# Altium schematic sheet TP4056电源模块.SchDoc
size A4
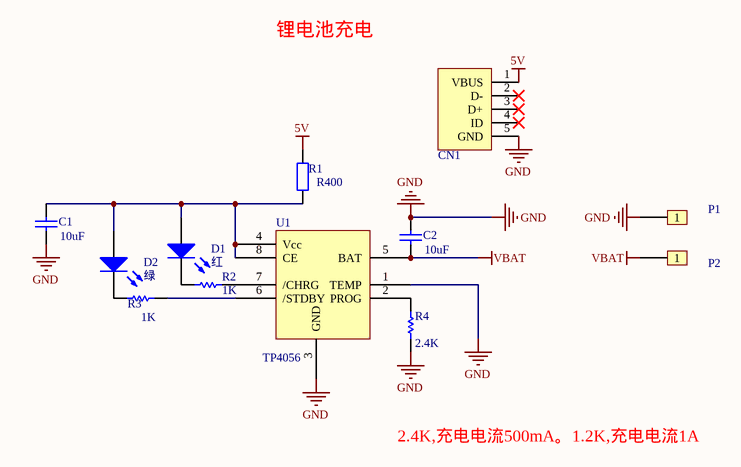
[diagram p0: TP4056电源模块.SchDoc]

## Parts
C1  value 10uF  [0603C]  (hidden comment: Cap)
C2  value 10uF  [0603C]  (hidden comment: Cap)
CN1  microUSB  [MICRO-USB]  (value not drawn)
D1  红  [0805D]
D2  绿  [0805D]
P1  Header1  [Header1]  (value not drawn)
P2  Header1  [Header1]  (value not drawn)
R1  value R400  [1206R]  (hidden comment: Res2)
R2  value 1K  [0603R]  (hidden comment: Res1)
R3  value 1K  [0603R]  (hidden comment: Res1)
R4  value 2.4K  [0603R]  (hidden comment: Res1)
U1  TP4056  [SOP-8]

## Nets
5V: CN1.1(VBUS) R1.2
GND: C1.1 C2.2 CN1.5(GND) P1.1 R4.1 U1.1(TEMP) U1.3(GND)
VBAT: C2.1 P2.1 U1.5(BAT)
NetC1_2: C1.2 D1.1(A) D2.1(A) R1.1 U1.4(Vcc) U1.8(CE)
NetD1_2: D1.2(K) R2.1
NetD2_2: D2.2(K) R3.1
NetR2_2: R2.2 U1.7(/CHRG)
NetR3_2: R3.2 U1.6(/STDBY)
NetR4_2: R4.2 U1.2(PROG)

Not connected (* = marked no-connect by the designer): CN1 2(D-)* 3(D+)* 4(ID)*

## Notes on the sheet
- 锂电池充电
- 2.4K,充电电流500mA。1.2K,充电电流1A

## Library data of the parts
C1 C2 = Cap: Capacitor; Published: 8-Jun-2000; LatestRevisionDate: 17-Jul-2002; LatestRevisionNote: Re-released for DXP Platform.; PackageReference: RAD-0.3; Publisher: Altium Limited
CN1 = USB_micro
D1 D2 = LED0: Typical INFRARED GaAs LED; Published: 8-Jun-2000; LatestRevisionDate: 08-Jul-2005; LatestRevisionNote: Mech Layer 1 removed.; PackageReference: LED-0; Publisher: Altium Limited
R1 = Res2: Resistor; Published: 8-Jun-2000; LatestRevisionDate: 17-Jul-2002; LatestRevisionNote: Re-released for DXP Platform.; PackageReference: AXIAL-0.4; Publisher: Altium Limited
R2-R4 = Res1: Resistor; Published: 8-Jun-2000; LatestRevisionDate: 17-Jul-2002; LatestRevisionNote: Re-released for DXP Platform.; PackageReference: AXIAL-0.3; Publisher: Altium Limited